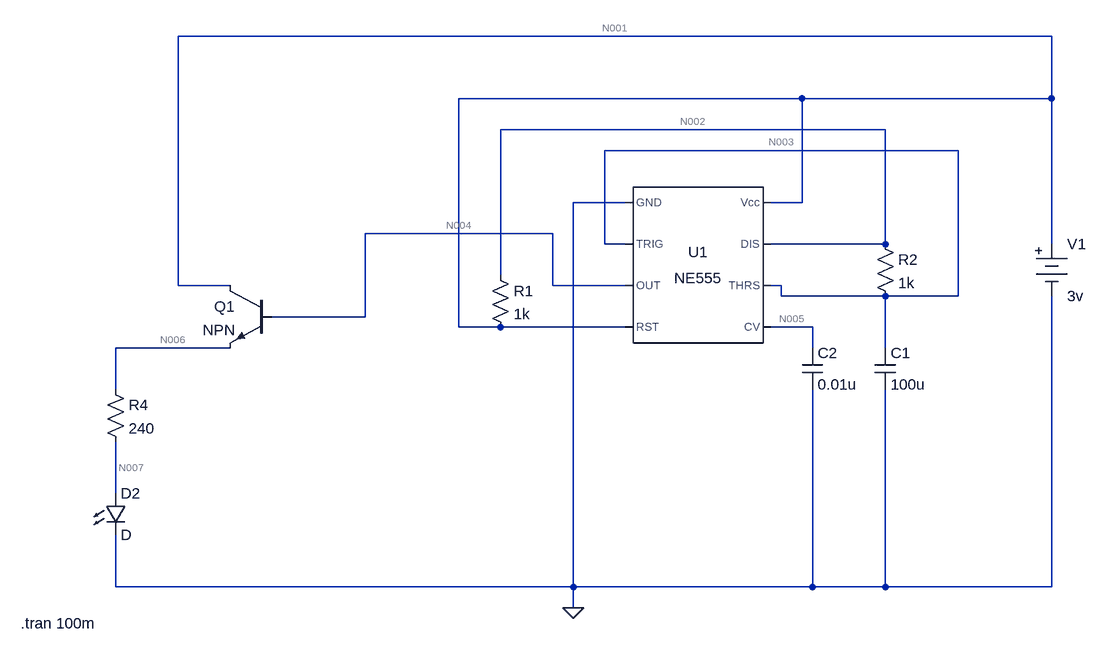
[diagram p0: schematic D-11_v-1-0_e-1_LMC555+PNP+NPN.asc]
D-11_v-1-0_e-1_LMC555+PNP+NPN.asc, the LTspice schematic file:
Version 4
SHEET 1 880 740
WIRE 752 -192 -592 -192
WIRE 368 -96 -160 -96
WIRE 752 -96 752 -192
WIRE 752 -96 368 -96
WIRE 496 -48 -96 -48
WIRE 608 -16 64 -16
WIRE 96 64 16 64
WIRE 368 64 368 -96
WIRE 368 64 320 64
WIRE -16 112 -304 112
WIRE 64 128 64 -16
WIRE 96 128 64 128
WIRE 496 128 496 -48
WIRE 496 128 320 128
WIRE 752 128 752 -96
WIRE -96 176 -96 -48
WIRE -592 192 -592 -192
WIRE -512 192 -592 192
WIRE -16 192 -16 112
WIRE 96 192 -16 192
WIRE 336 192 320 192
WIRE 336 208 336 192
WIRE 496 208 336 208
WIRE 608 208 608 -16
WIRE 608 208 496 208
WIRE -304 240 -304 112
WIRE -304 240 -448 240
WIRE -160 256 -160 -96
WIRE -96 256 -160 256
WIRE 96 256 -96 256
WIRE 384 256 320 256
WIRE -512 288 -688 288
WIRE 384 288 384 256
WIRE 496 288 496 208
WIRE -688 352 -688 288
WIRE -688 512 -688 432
WIRE -688 656 -688 576
WIRE 16 656 16 64
WIRE 16 656 -688 656
WIRE 384 656 384 352
WIRE 384 656 16 656
WIRE 496 656 496 352
WIRE 496 656 384 656
WIRE 752 656 752 208
WIRE 752 656 496 656
WIRE 16 688 16 656
FLAG 16 688 0
SYMBOL Misc\\NE555 208 160 R0
SYMATTR InstName U1
SYMBOL res -112 160 R0
SYMATTR InstName R1
SYMATTR Value 1k
SYMBOL res 480 112 R0
SYMATTR InstName R2
SYMATTR Value 1k
SYMBOL cap 480 288 R0
SYMATTR InstName C1
SYMATTR Value 100u
SYMBOL cap 368 288 R0
SYMATTR InstName C2
SYMATTR Value 0.01u
SYMBOL Misc\\battery 752 112 R0
SYMATTR InstName V1
SYMATTR Value 3v
SYMBOL npn -448 192 M0
SYMATTR InstName Q1
SYMBOL res -704 336 R0
SYMATTR InstName R4
SYMATTR Value 240
SYMBOL LED -704 512 R0
SYMATTR InstName D2
TEXT -834 712 Left 2 !.tran 100m

The netlist it stands for:
* D-11_v-1-0_e-1_LMC555+PNP+NPN.asc
XU1 0 N003 N004 N001 N005 N003 N002 N001 NE555  ; pins GND TRIG OUT RST CV THRS DIS Vcc
R1 N002 N001 1k
R2 N002 N003 1k
C1 N003 0 100u
C2 N005 0 0.01u
V1 N001 0 3v
Q1 N001 N004 N006 0 NPN
R4 N006 N007 240
D2 N007 0 D
.model D D
.lib standard.dio
.model NPN NPN
.model PNP PNP
.lib standard.bjt
.tran 100m
.lib NE555.sub
.backanno
.end

* Results of the author's LTspice run, read from the files saved beside the schematic
* Operating Point, zero values left out:
*   V(n003) = 3 V
*   V(n005) = 2 V
*   V(n001) = 3 V
*   V(n002) = 3 V
*   V(n004) = 3 V
*   V(n006) = 2.179 V
*   V(n007) = 702.1 mV
*   Ic(Q1) = 6.091 mA
*   Ib(Q1) = 60.91 µA
*   Ie(Q1) = -6.152 mA
*   I(D2) = 6.152 mA
*   I(R4) = 6.152 mA
*   I(R2) = 6 nA
*   I(R1) = -10 nA
*   I(V1) = -7.115 mA
*   Ix(u1:1) = -962.3 µA
*   Ix(u1:2) = 3 nA
*   Ix(u1:3) = -60.91 µA
*   Ix(u1:4) = 9.333 µA
*   Ix(u1:6) = 3 nA
*   Ix(u1:7) = 4.003 nA
*   Ix(u1:8) = 1.014 mA
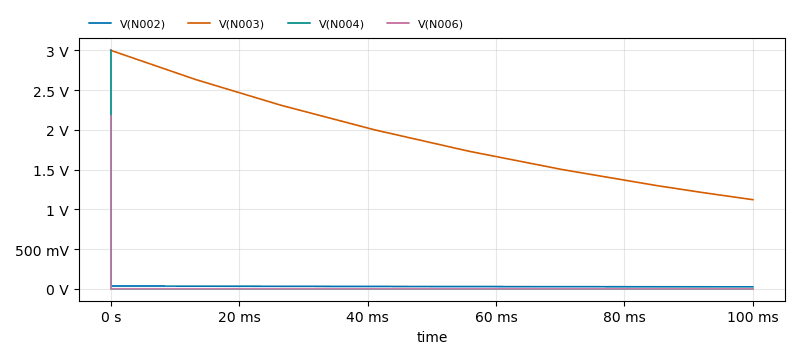
[diagram p1: Transient Analysis of D-11_v-1-0_e-1_LMC555+PNP+NPN.asc, plotted from the saved traces]
* Transient Analysis, 1 run:
*   V(N002): min 24.44 mV, max 3 V, average 29.12 mV, rms 29.5 mV, last 24.44 mV
*   V(N003): min 1.121 V, max 3 V, average 1.91 V, rms 1.988 V, last 1.121 V
*   V(N004): min 18 µV, max 3 V, average 21.09 µV, rms 2.988 mV, last 18 µV
*   V(N006): min 49.38 µV, max 2.179 V, average 51.62 µV, rms 2.164 mV, last 49.38 µV